# EasyEDA schematic Schematic_Alarm_clock.json
TITLE: Menu_Display; REV: 1.0; Date: 2021-05-31; Sheet: 1/1; Drawn By: SeniruD2000; Company: Your Company
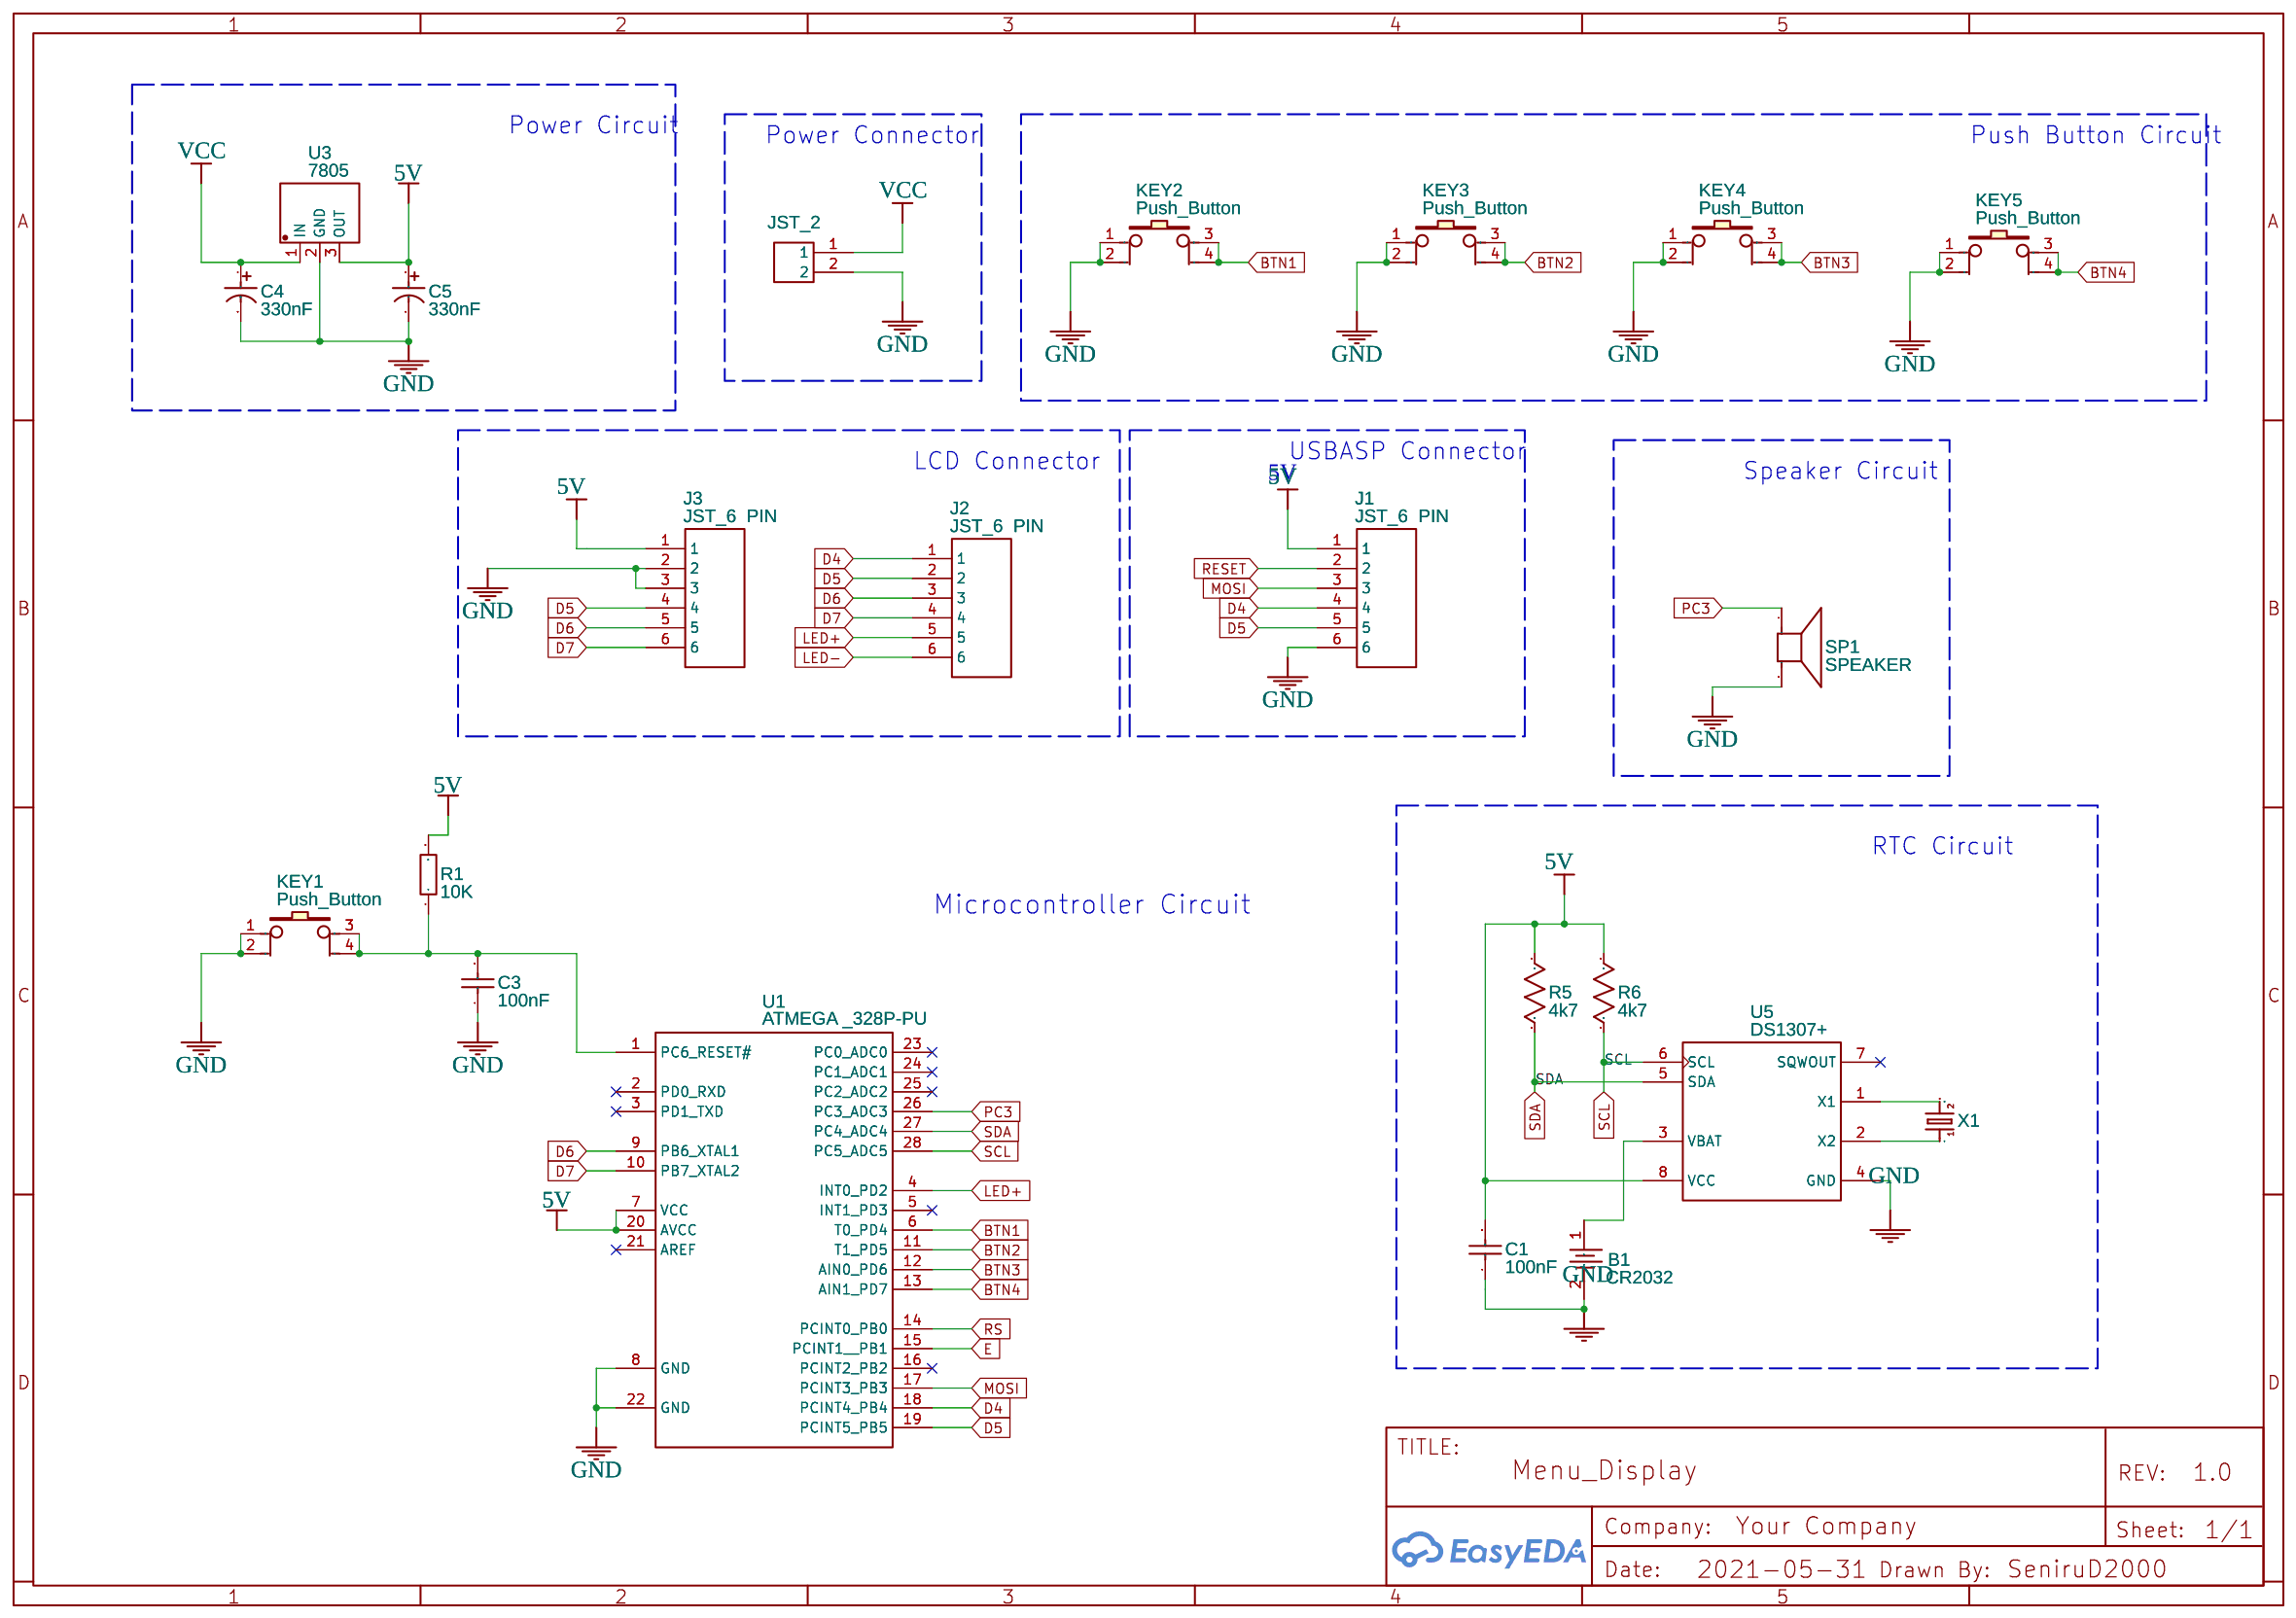
[diagram p0: schematic sheet]

## Parts
B1  CR2032  [BATTERY-1]
C1  100nF  [RAD-0.2]
C3  100nF  [RAD-0.2]
C4  330nF  [CAP-TH_BD5.0-P2.00-D0.8-FD]
C5  330nF  [CAP-TH_BD5.0-P2.00-D0.8-FD]
CN1  JST_2  [CONN-TH_XHB-2A]
J1  JST_6  PIN  [JST 2.54MM MALE 6 PIN CONNECTOR_N]
J2  JST_6  PIN  [JST 2.54MM MALE 6 PIN CONNECTOR_N]
J3  JST_6  PIN  [JST 2.54MM MALE 6 PIN CONNECTOR_N]
KEY1  Push_Button  [KEY-TH_4P-L6.0-W6.0-P4.50]
KEY2  Push_Button  [KEY-TH_4P-L6.0-W6.0-P4.50]
KEY3  Push_Button  [KEY-TH_4P-L6.0-W6.0-P4.50]
KEY4  Push_Button  [KEY-TH_4P-L6.0-W6.0-P4.50]
KEY5  Push_Button  [KEY-TH_4P-L6.0-W6.0-P4.50]
R1  10K  [AXIAL-0.4]
R5  4k7  [AXIAL-0.3]
R6  4k7  [AXIAL-0.3]
SP1  SPEAKER  [SPEAKER]
U1  ATMEGA _328P-PU  [DIP-28_L34.6-W7.3-P2.54-LS10.2-BL]
U3  7805  [TO-220-3_L10.0-W4.5-P2.54-L]
U5  DS1307+  [DIP-8]
X1  CRYSTALTC26H_EZ  [TC26HEZ]

## Library data of the parts
B1 = -: Supplier: LCSC; Manufacturer: Q&J; Manufacturer Part: BS-2-1; Supplier Part: C70376
C1 C3 = 100nF: Supplier: LCSC; Manufacturer: LCSC; Manufacturer Part: 0.1UF(104) +-20% 63v; Supplier Part: C19355
C4 C5 = 0.33uF: Supplier: LCSC; Manufacturer: ValuePro; Manufacturer Part: 0.33uF 50V 5*11; Supplier Part: C45097; JLCPCB Part Class: Extended Part
CN1 = JST_2 PIN: Supplier: LCSC; Manufacturer: BOOMELE; Manufacturer Part: XHB-2A Connector; image: //image.lceda.cn/szlcsc/C57981.jpg; Supplier Part: C57981; JLCPCB Part Class: Extended Part
J1-J3 = JST_6  PIN: Contributor: MagnusInc
KEY1-KEY5 = Push_Button: Supplier Part: C59980; Supplier: LCSC; Manufacturer: ReliaPro; Manufacturer Part: button6*6*8.5; image: http://image.lceda.cn/szlcsc/C59980.jpg
R1 = RESISTOR: Power: 1/4W; Tolerance: ±1%; EasyEDA: E57439; Supplier Part: E57439; Supplier: EasyEDA; Manufacturer: UniOhm; Manufacturer Part: MFR0W4F2200A50
R5 R6 = Resistor: Manufacturer Part: ?
SP1 = SPEAKER: Contributor: dthal
U1 = ATMEGA _328P-PU: sourceId: Oic6oiASL; Supplier: LCSC; Manufacturer: MICROCHIP; Manufacturer Part: ATMEGA328P-PU; image: //image.lceda.cn/szlcsc/C33901.jpg; Contributor: LCSC; Supplier Part: C33901
U3 = 7805_Regulator: Supplier: LCSC; Supplier Part: C305416; Manufacturer: Foshan Blue Rocket Elec; Contributor: LCSC; JLCPCB Part Class: Extended Part
U5 = -: Supplier: LCSC; Manufacturer: MAXIM; Supplier Part: C59267
X1 = -: Various standard crystals. Proven footprints.; catid: 20; Contributor: SparkFun; Manufacturer Part: ?

## Nets
5V: C1.2 C5.1 J1.1 J3.1 R1.2 R5.1 R6.2 U1.7(VCC) U1.20(AVCC) U3.3(OUT) U5.8(VCC)
GND: B1.2 C1.1 C3.1 C4.2 C5.2 CN1.2 J1.6 J3.2 J3.3 KEY1.1 KEY1.2 KEY2.1 KEY2.2 KEY3.1 KEY3.2 KEY4.1 KEY4.2 KEY5.1 KEY5.2 SP1.2(-) U1.8(GND) U1.22(GND) U3.2(GND) U5.4(GND)
VCC: C4.1 CN1.1 U3.1(IN)
BTN1: KEY2.3 KEY2.4 U1.6(T0 PD4)
BTN2: KEY3.3 KEY3.4 U1.11(T1 PD5)
BTN3: KEY4.3 KEY4.4 U1.12(AIN0 PD6)
BTN4: KEY5.3 KEY5.4 U1.13(AIN1 PD7)
D4: J1.4 J2.1 U1.18(PCINT4 PB4)
D5: J1.5 J2.2 J3.4 U1.19(PCINT5 PB5)
D6: J2.3 J3.5 U1.9(PB6 XTAL1)
D7: J2.4 J3.6 U1.10(PB7 XTAL2)
E: U1.15(PCINT1  PB1)
LED+: J2.5 U1.4(INT0 PD2)
LED-: J2.6
MOSI: J1.3 U1.17(PCINT3 PB3)
PC3: SP1.1(+) U1.26(PC3 ADC3)
RESET: J1.2
RS: U1.14(PCINT0 PB0)
SCL: R6.1 U1.28(PC5 ADC5) U5.6(SCL)
SDA: R5.2 U1.27(PC4 ADC4) U5.5(SDA)
Net-(B1-1): B1.1 U5.3(VBAT)
Net-(C3-2): C3.2 KEY1.3 KEY1.4 R1.1 U1.1(PC6 RESET#)
Net-(U5-1): U5.1(X1) X1.2
Net-(U5-2): U5.2(X2) X1.1

Not connected (* = marked no-connect by the designer): U1 2(PD0 RXD)* 3(PD1 TXD)* 5(INT1 PD3)* 16(PCINT2 PB2)* 21(AREF)* 23(PC0 ADC0)* 24(PC1 ADC1)* 25(PC2 ADC2)*; U5 7(SQWOUT)*

## Notes on the sheet
- Power Circuit
- Power Connector
- Push Button Circuit
- USBASP Connector
- LCD Connector
- 5V
- Speaker Circuit
- RTC Circuit
- Microcontroller Circuit
